# EAGLE design placa_4sensores_Certa (EAGLE 6.5.0)
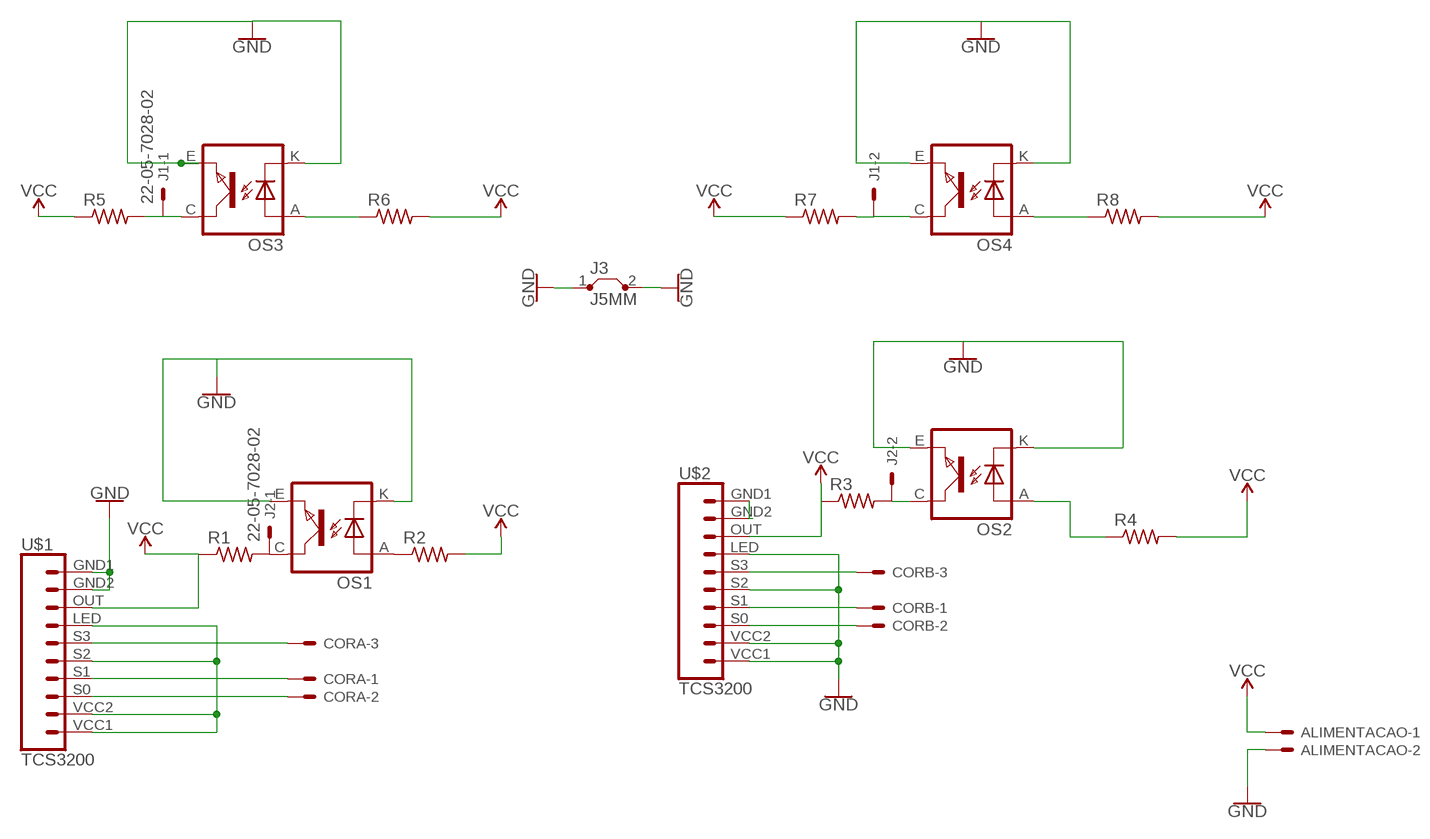
[diagram p0: schematic, sheet 1]

## Parts
ALIMENTACAO  22-05-7028-02  [7395-02]
CORA  22-05-7038-03  [7395-03]
CORB  22-05-7038-03  [7395-03]
J1  22-05-7028-02  [7395-02]
J2  22-05-7028-02  [7395-02]
J3  J5MM  [05]
OS1  TCRT5000  [TCRT5000]
OS2  TCRT5000  [TCRT5000]
OS3  TCRT5000  [TCRT5000]
OS4  TCRT5000  [TCRT5000]
R1  R-US_0204/5  [0204/5]
R2  R-US_0204/5  [0204/5]
R3  R-US_0204/5  [0204/5]
R4  R-US_0204/5  [0204/5]
R5  R-US_0204/5  [0204/5]
R6  R-US_0204/5  [0204/5]
R7  R-US_0204/5  [0204/5]
R8  R-US_0204/5  [0204/5]
U$1  TCS3200  [TCS3200]
U$2  TCS3200  [TCS3200]

## Nets
GND: ALIMENTACAO.2 J3.1 J3.2 OS1.E(EMITTER) OS1.K(CATHODE) OS2.E(EMITTER) OS2.K(CATHODE) OS3.E(EMITTER) OS3.K(CATHODE) OS4.E(EMITTER) OS4.K(CATHODE) U$1.GND1 U$1.GND2 U$2.LED U$2.S2 U$2.VCC1 U$2.VCC2
N$1: CORA.2 U$1.S0
N$2: CORB.1 U$2.S1
N$3: CORB.2 U$2.S0
N$4: CORA.3 U$1.S3
N$5: CORA.1 U$1.S1
N$6: CORB.3 U$2.S3
N$7: OS1.A(ANODE) R2.1
N$8: J2.1 OS1.C(COLLECTOR) R1.2
N$9: J2.2 OS2.C(COLLECTOR) R3.2
N$10: U$1.LED U$1.S2 U$1.VCC1 U$1.VCC2
N$11: OS2.A(ANODE) R4.1
N$12: OS3.A(ANODE) R6.1
N$13: J1.1 OS3.C(COLLECTOR) R5.2
N$15: J1.2 OS4.C(COLLECTOR) R7.2
N$16: OS4.A(ANODE) R8.1
VCC: ALIMENTACAO.1 R1.1 R2.2 R3.1 R4.2 R5.1 R6.2 R7.1 R8.2 U$1.OUT U$2.OUT
Unconnected: U$2.GND1 U$2.GND2

## Library data of the parts
ALIMENTACAO J1 J2 = con-molex:22-?-02: CONNECTOR wire to board 2.54 mm (.1 inch) pitch header; OC_FARNELL: 9731601; OC_NEWARK: unknown
CORA CORB = con-molex:22-?-03: CONNECTOR wire to board 2.54 mm (.1 inch) pitch header; OC_FARNELL: unknown; OC_NEWARK: unknown
J3 = jumper:J: Bridge
OS1-OS4 = Robotica-IFRN-SC:TCRT5000
R1-R8 = rcl:R-US_: RESISTOR, American symbol
U$1 U$2 = Robotica-IFRN-SC-sensores_atualizado:TCS3200

## Board
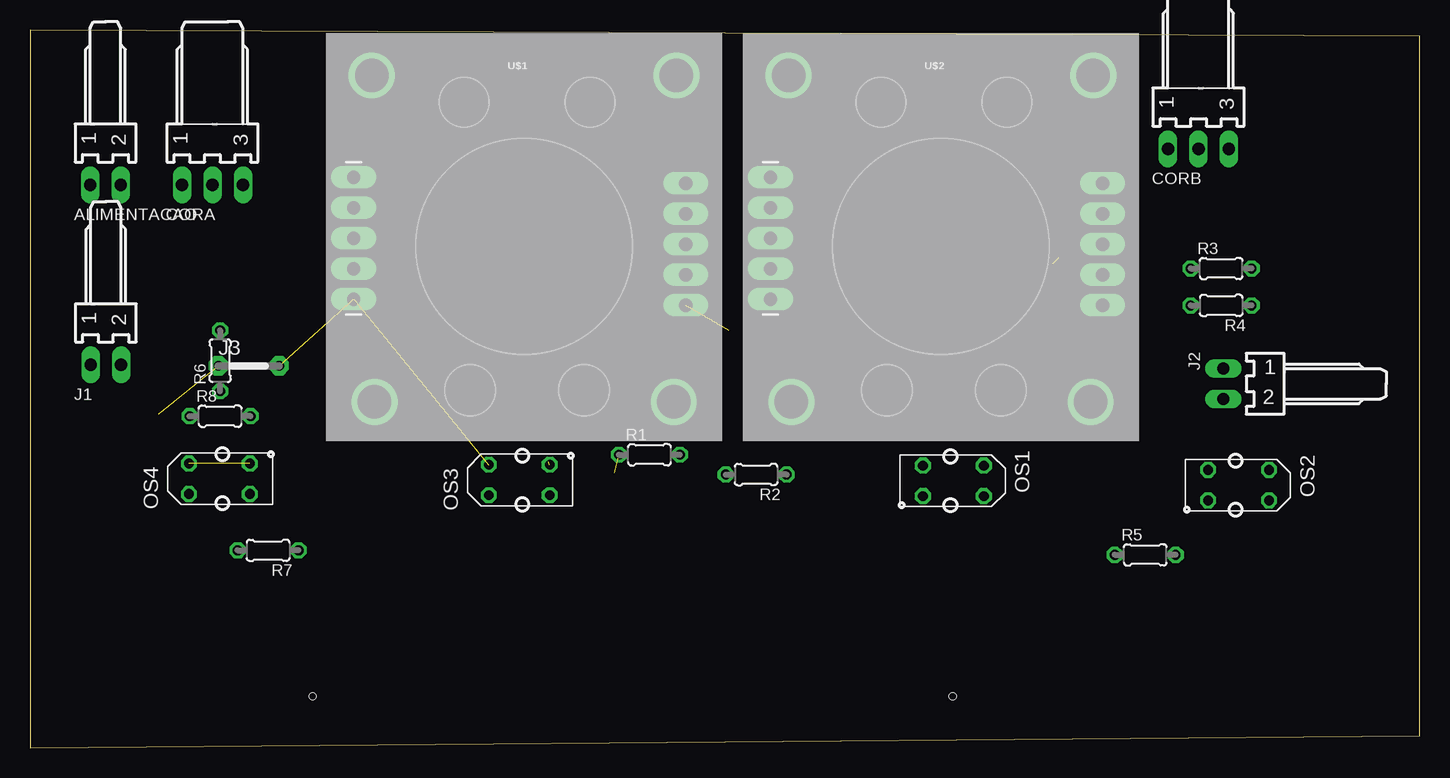
[diagram p1: board, top side]
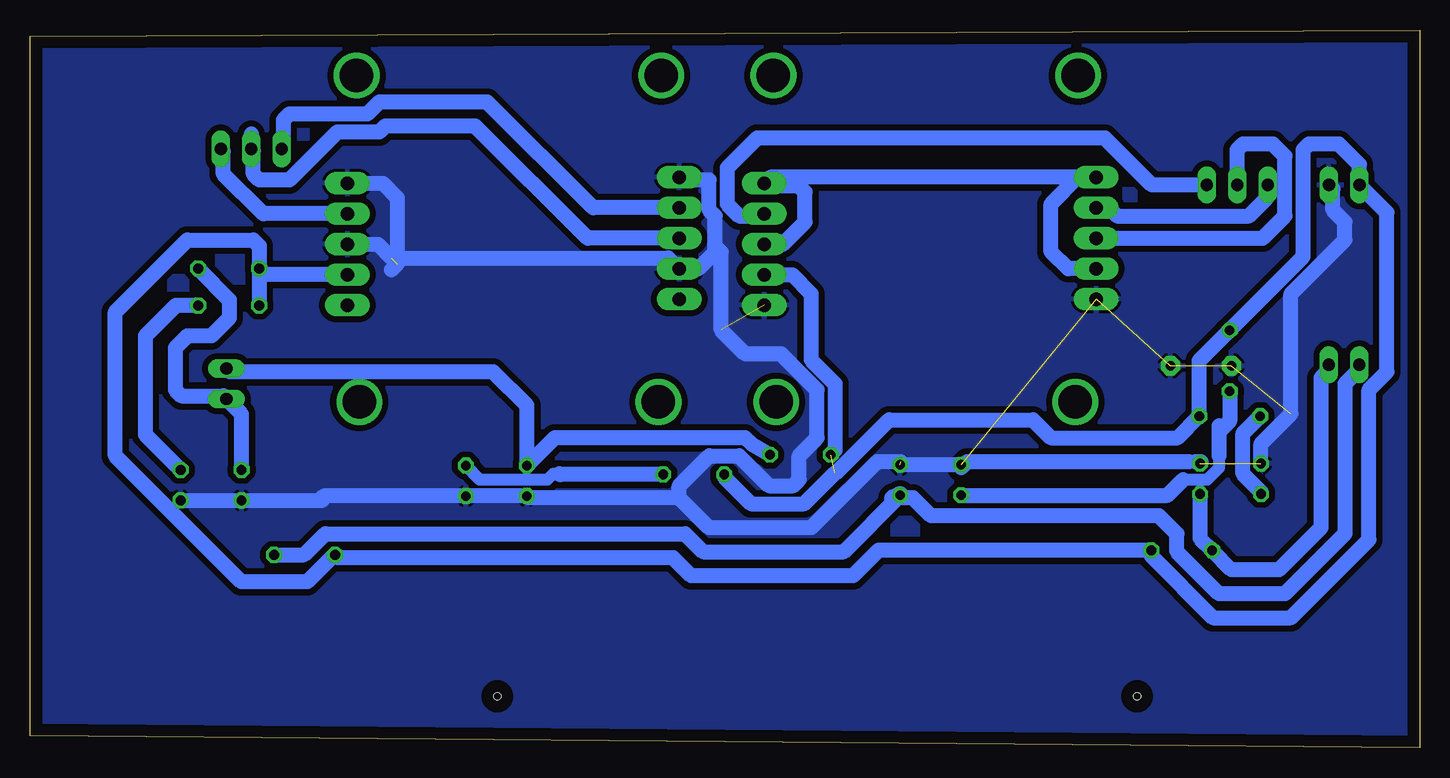
[diagram p2: board, bottom side, seen from below]

Size 115.86 x 59.87 mm. Coordinates in mm from the lower left corner, seen from the top.
Outline: 0,0 115.86,1 115.86,59.37 0,59.87 0,0
Copper layers (1*16): Top 0.035mm / dielectric 1.5mm / Bottom 0.035mm
Design rules "default *": minimum track width 60mil, minimum drill 24mil, track to track 20mil, track to pad 20mil, pad to pad 20mil, via to via 20mil, smd to smd 8mil, copper to edge 40mil, drill to drill 8mil, minimum pad ring 10mil, minimum via ring 8mil, stop-mask expansion 4mil, vias tented up to drill 0mil, thermal gap 10mil
Holes 0.6 mm at 62.93,-31.25 95.95,-9.66 76.9,4.31 23.56,4.31

### Footprints (pad centres in the part's own frame; a part is rotated, then mirrored left to right if it is on the bottom)
7395-02 = drill 1.016 long: 1 1.27,0; 2 -1.27,0
7395-03 = drill 1.016 long: 1 2.54,0; 2 0,0; 3 -2.54,0
05 = drill 0.813 pad 1.6 octagon: 1 -2.54,0; 2 2.54,0
TCRT5000 = drill 0.8 octagon: A -2.54,-1.27; C 2.54,-1.27; E 2.54,1.27; K -2.54,1.27
0204/5 = drill 0.813 octagon: 1 -2.54,0; 2 2.54,0
TCS3200 = drill 1.118 pad 1.88 long: GND1 -13.46,4.91; GND2 14.21,4.41; LED 14.21,1.87; OUT -13.46,2.37; S0 14.21,-0.67; S1 14.21,-3.21; S2 -13.46,-0.17; S3 -13.46,-2.71; VCC1 -13.46,-5.25; VCC2 14.21,-5.75 | drill 2.8: P$1 -12.7,-14.24; P$2 -12.47,12.97; P$3 12.47,12.97; P$4 12.7,-14.24

### Placement (x,y rotation side)
ALIMENTACAO  6.3,46.95 180 top
CORA  15.21,46.95 180 top
CORB  97.41,49.95 180 top
J1  6.32,31.95 180 top
J2  99.48,30.37 90 top
J3  18.24,31.87 0 top
OS1  76.98,22.28 180 top
OS2  100.76,21.92 180 top
OS3  40.78,22.34 0 top
OS4  15.78,22.45 0 top
R1  51.64,24.45 0 top
R2  60.53,22.8 180 top
R3  99.3,39.98 0 top
R4  99.3,36.9 180 top
R5  92.97,16.1 0 top
R6  15.85,32.29 90 top
R7  19.85,16.48 180 top
R8  15.85,27.67 0 top
U$1  41.19,41.83 180 top
U$2  75.94,41.83 180 top

### Tracks (layer width: path | path; a pad name or v marks a point on that pad's centre or on a via)
GND  (8 unrouted)
  Bottom 1.27: OS3.K 42.98,23.61 43.24,23.87 45.24,23.87 50.74,18.37 59.24,18.37 61.74,20.87 | 61.74,20.87 74.3,20.87 OS1.E OS1.K 91.38,21.01 91.74,20.64 | OS2.K OS2.E 91.74,20.64 | 91.74,20.64 91.46,20.64 | 58.74,41.87 58.74,41.37 60.15,39.96 U$2.LED 62.64,40.87 85.74,40.87 86.87,42 U$2.S2 | 58.74,41.87 58.74,44.37 59.24,44.87 59.24,47.37 61.52,47.37 U$2.VCC2 | U$2.VCC1 86.45,47.08 85.24,45.87 85.24,40.37 85.74,39.87 | 61.74,20.87 61.74,21.87 59.24,24.37 56.74,24.37 54.24,21.87 52.24,21.87 51.74,22.37 51.74,24.37 50.24,25.87 50.24,29.87 53.24,32.87 56.24,32.87 58.24,34.87 58.24,41.37 58.74,41.87 | OS4.K 13.24,25.37 10.74,27.87 10.74,37.87 6.24,42.37 6.24,43.87 7.24,44.87 7.24,46.62 ALIMENTACAO.2
  pour Bottom: -0.5,59.88 115.69,59.38 115.69,1 0,0
N$1
  Bottom 1.27: U$1.S0 13.11,42.5 11.24,44.37 11.24,49.37 12.24,50.37 14.74,50.37 15.24,49.87 15.24,46.98 CORA.2
N$2
  Bottom 1.27: U$2.S1 68.91,45.04 77.74,53.87 86.74,53.87 87.74,52.87 94.24,52.87 94.74,52.37 94.74,50.08 CORB.1
N$3
  Bottom 1.27: 97.41,51.2 CORB.2 97.24,49.78 97.24,47.87 96.74,47.37 94.24,47.37 90.24,51.37 86.74,51.37 86.24,51.87 78.74,51.87 69.37,42.5 U$2.S0
N$4
  Bottom 1.27: CORA.3 22.32,46.95 26.24,50.87 55.24,50.87 57.74,48.37 57.74,45.37 56.74,44.37 54.82,44.37 U$1.S3
N$5
  Bottom 1.27: U$1.S1 25.91,45.04 25.24,44.37 14.24,44.37 12.74,45.87 12.74,46.88 CORA.1
N$6
  Bottom 1.27: U$2.S3 96.41,44.54 99.74,47.87 99.74,49.74 CORB.3
N$7
  Bottom 1.016: 71.74,22.87 72.24,22.87 72.74,22.37 78.34,22.37 OS1.A
  Bottom 1.27: R2.1 71.67,22.8 71.74,22.87
N$8
  Bottom 1.27: J2.1 99.21,31.37 77.24,31.37 74.44,28.57 OS1.C 72.12,25.87 56.24,25.87 55.68,25.31 R1.2
N$9
  Bottom 1.27: OS2.C 98.22,27.84 J2.2 99.75,29.37 103.24,29.37 103.74,29.87 103.74,33.37 102.74,34.37 100.74,34.37 99.24,35.87 99.24,37.37 R3.2
N$10
  Bottom 1.27: U$1.S2 53.11,42 51.24,43.87 51.24,46.37 51.74,46.87 54.44,46.87 U$1.VCC1 54.15,47.58 U$1.VCC2 28.53,47.58 30.74,45.37 30.74,41.37 29.33,39.96 U$1.LED
N$11
  Bottom 1.27: R4.1 103.71,36.9 106.24,34.37 106.24,26.13 OS2.A
N$12
  Bottom 1.016: 16.74,24.37 16.74,23.37 17.74,22.37 19.74,22.37
  Bottom 1.27: 16.74,26.87 16.74,26.37 | 16.74,26.37 16.74,24.37 | OS3.A 21.04,21.07 19.74,22.37 | R6.1 15.85,27.26 16.74,26.37
N$13
  Bottom 1.27: J1.1 5.05,31.56 6.24,30.37 6.24,17.87 11.24,12.87 16.74,12.87 20.24,16.37 20.24,17.87 21.74,19.37 40.74,19.37 42.24,20.87 43.12,20.87 OS3.C 48.02,16.37 59.74,16.37 61.24,17.87 91.24,17.87 93.01,16.1 R5.2
  Bottom 1.524: 43.88,20.82 OS3.C
N$15
  Bottom 1.27: OS4.C 18.32,17.49 R7.2 15.7,14.87 11.74,14.87 8.24,18.37 8.24,30.87 7.59,31.52 J1.2
N$16
  Bottom 1.27: OS4.A 13.24,21.37 14.74,22.87 14.74,26.24 R8.1
N$17
  pour Bottom: -0.26,59.87 -0.26,0.87 -1.26,0.37 115.74,0.87 115.74,59.37
N$22
  Bottom 1.27: 18.24,23.87 18.74,23.87
N$35
  Bottom 1.27: 19.24,23.87 37.74,23.87 38.24,23.37
VCC  (1 unrouted)
  Bottom 1.27: U$1.OUT 52.33,39.46 50.74,37.87 50.74,32.37 48.74,30.37 48.74,24.81 R1.1 | R2.2 57.99,22.62 55.74,20.37 51.32,20.37 48.74,22.95 48.66,22.95 44.24,27.37 32.24,27.37 30.74,25.87 20.19,25.87 R8.2 18.39,32.29 R6.2 9.74,40.94 9.74,49.87 9.24,50.37 6.74,50.37 5.03,48.66 ALIMENTACAO.1 2.74,44.66 2.74,31.37 4.24,29.87 4.24,17.37 10.74,10.87 17.24,10.87 22.39,16.02 R7.1 45.13,16.48 47.24,14.37 60.74,14.37 62.24,15.87 90.2,15.87 R5.1 90.51,16.1 92.74,13.87 98.24,13.87 108.74,24.37 108.74,36.37 102.74,42.37 97.24,42.37 96.74,41.87 96.74,40 R3.1 | U$2.OUT 96.24,39.46 R3.1 | R3.1 R4.2